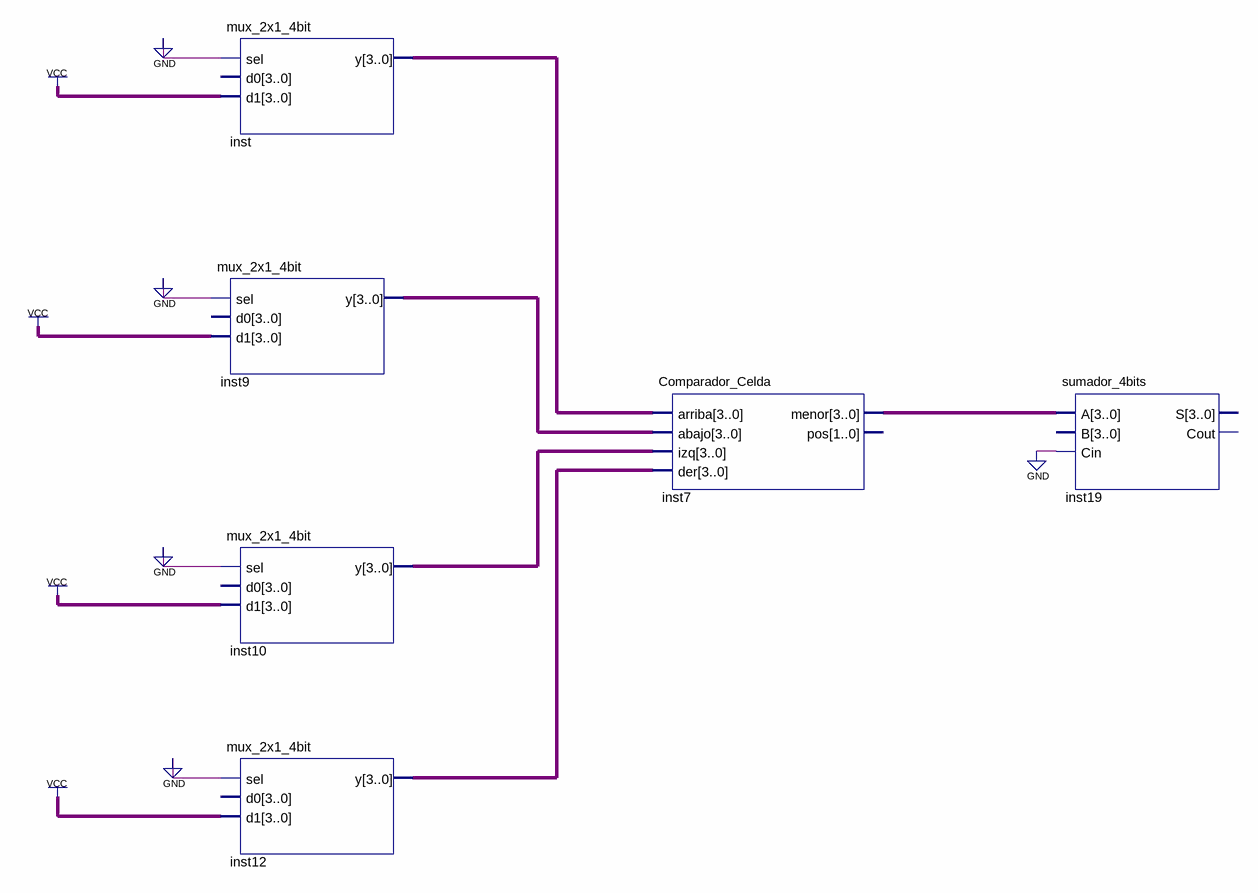
[diagram p0: schematic sheet]
// Quartus schematic floodfill.bdf as structural Verilog: 6 symbols, 0 pins
module floodfill (
);

  wire [3:0] inst7_menor, inst9_y, inst10_y, inst12_y, inst_y;

  mux_2x1_4bit inst (.sel(1'b0), .d1(4'b1111), .y(inst_y));  // open: d0
  mux_2x1_4bit inst9 (.sel(1'b0), .d1(4'b1111), .y(inst9_y));  // open: d0
  mux_2x1_4bit inst10 (.sel(1'b0), .d1(4'b1111), .y(inst10_y));  // open: d0
  mux_2x1_4bit inst12 (.sel(1'b0), .d1(4'b1111), .y(inst12_y));  // open: d0
  Comparador_Celda inst7 (
    .arriba(inst_y), .abajo(inst9_y), .izq(inst10_y), .der(inst12_y), .menor(inst7_menor));  // open: pos
  sumador_4bits inst19 (.A(inst7_menor), .Cin(1'b0));  // open: B, S, Cout
endmodule
